# Altium schematic sheet IMU_breakout.SchDoc
size 594 x 420 mm
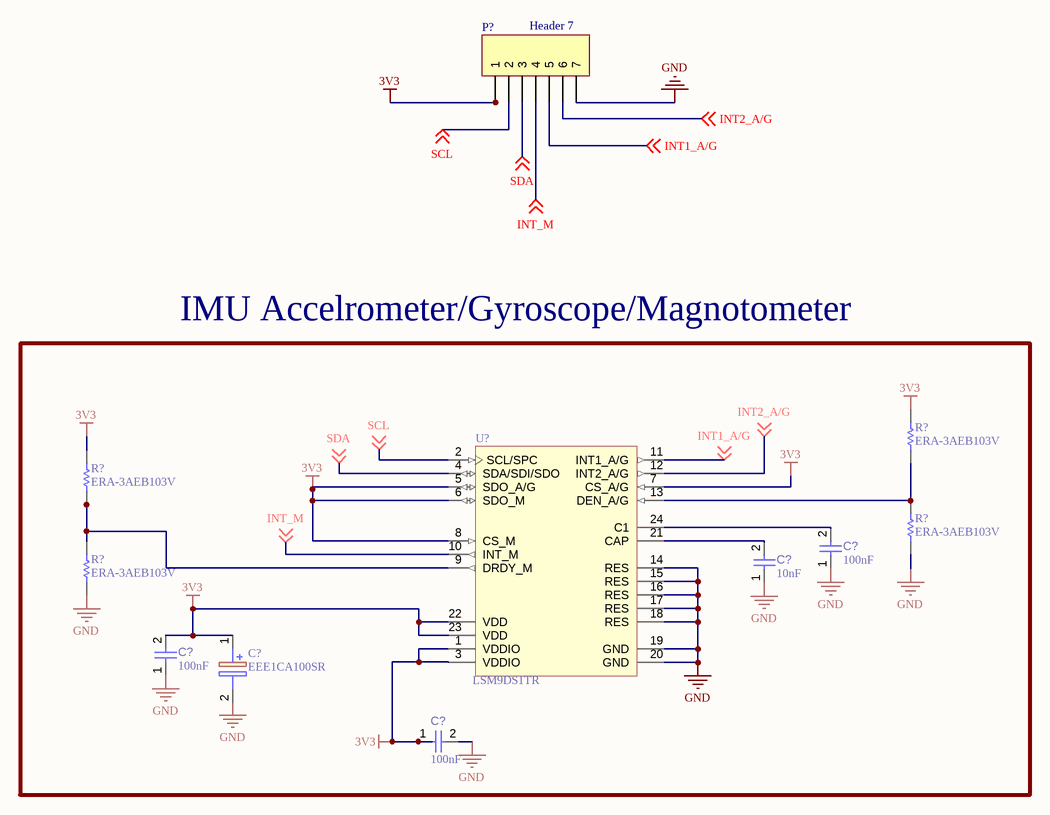
[diagram p0: IMU_breakout.SchDoc]

## Parts
(Parts that share a designator on the sheet are numbered #1, #2 ... from top to bottom, then left to right.)
C?#1  value 100nF  [CAPC1608X90X40ML10T20]  (hidden comment: Capacitor 100 nF +/-10% 50 V 0603)
C?#2  value 10nF  [CAPC0402(1005)60_L]  (hidden comment: Capacitor 10nF +/-20% 50V 0402)
C?#3  EEE1CA100SR  [CAPAE430X550N]
C?#4  value 100nF  [CAPC1608X90X40ML10T20]  (hidden comment: Capacitor 100 nF +/-10% 50 V 0603)
C?#5  value 100nF  [CAPC1608X90X40ML10T20]  (hidden comment: Capacitor 100 nF +/-10% 50 V 0603)
P?  Header 7  [HDR1X7]
R?#1  ERA-3AEB103V  [RESC1608X55X30ML20T20]
R?#2  ERA-3AEB103V  [RESC1608X55X30ML20T20]
R?#3  ERA-3AEB103V  [RESC1608X55X30ML20T20]
R?#4  ERA-3AEB103V  [RESC1608X55X30ML20T20]
U?  LSM9DS1TR  [STM-LGA-24_3500X3000X1000]

## Blocks framed on the sheet
IMU Accelrometer/Gyroscope/Magnotometer: C?#1-C?#5 R?#1-R?#4 U?

## Nets
3V3: C?#3.1(+) C?#4.2 C?#5.1 P?.1 R?#1.2 R?#2.1 U?.1(VDDIO) U?.3(VDDIO) U?.5(SDO_A/G) U?.6(SDO_M) U?.7(CS_A/G) U?.8(CS_M) U?.22(VDD) U?.23(VDD)
GND: C?#1.1 C?#2.1 C?#4.1 C?#5.2 P?.7 R?#3.1 R?#4.2 U?.14(RES) U?.15(RES) U?.16(RES) U?.17(RES) U?.18(RES) U?.19(GND) U?.20(GND)
INT1_A/G: P?.5 U?.11(INT1_A/G) ; off-sheet INT1_A/G
INT2_A/G: P?.6 U?.12(INT2_A/G) ; off-sheet INT2_A/G
INT_M: P?.4 U?.10(INT_M) ; off-sheet INT_M
SCL: P?.2 U?.2(SCL/SPC) ; off-sheet SCL
SDA: P?.3 U?.4(SDA/SDI/SDO) ; off-sheet SDA
NetC?#1_2: C?#1.2 U?.24(C1)
NetC?#2_2: C?#2.2 U?.21(CAP)
NetR?#1_1: R?#1.1 R?#3.2 U?.13(DEN_A/G)
NetR?#2_2: R?#2.2 R?#4.1 U?.9(DRDY_M)

Not connected (* = marked no-connect by the designer): C?#3 2(-)

## Notes on the sheet
- Labels drawn without touching a wire or pin: GND
- 10
- 9
- 8
- 7
- 6
- 5
- 4
- 3
- DWG. NO.
- 2
- 1
- THIS DOCUMENT AND THE DATA DISCLOSED HEREIN OR HEREWITH IS THE PROPERTY OF ALTIUM LIMITED AND MAY BE FREELY DISTRIBUTED IN WHOLE. NO RIGHTS ARE RESERVED OR EXPRESS OR IMPLIED WARANTEE GIVEN.
- REV.
- SHT.
- REVISION
- DESCRIPTION
- DATE
- APPROVED
- H
- G
- F
- E
- D
- C
- B
- A
- TITLE
- SCALE:
- A2
- SIZE
- CAGE CODE
- FILE NAME
- DWG NO.
- SHEET
- OF
- REV

## Library data of the parts
C?#1 C?#4 C?#5 = CMP-001-00017-4: Chip Capacitor, 100 nF, +/- 10%, 50 V, 0603 (1608 Metric); Capacitor Type: Ceramic; Voltage Rating: 50V; RoHS Compliant: True; Max Operating Temperature: 125°C; Pins: 2; Mounting Technology: SM; Min Operating Temperature: -55°C; Tolerance: 10%; Case/Package: 0603
C?#2 = CMP-001-00069-2: Chip Capacitor, 10nF +/-20%, 50V, 0402, Thickness 0.6 mm; Tolerance: 5%; Voltage Rating: 50V; Pins: 2; Max Operating Temperature: 85°C; Mounting Technology: SMT; Min Operating Temperature: -55°C; Case/Package: 0402
C?#3 = EEE1CA100SR: Capacitor Polarised; Manufacturer_Name: Panasonic; Datasheet Link: https://industrial.panasonic.com/cdbs/www-data/pdf/RDE0000/ABA0000C1145.pdf; Height: 5.5mm; Manufacturer_Part_Number: EEE1CA100SR; Arrow Part Number: EEE1CA100SR
P? = Header 7: Header, 7-Pin; LatestRevisionDate: 17-Jul-2002; LatestRevisionNote: Re-released for DXP Platform.; Publisher: Altium Limited
R?#1-R?#4 = CMP-2000-00874-1: Manufacturer: Panasonic; Part Number: ERA-3AEB103V
U? = CMP-2000-06606-1: iNEMO Inertial Module: 3D Accelerometer, 3D Gyroscope, 3D Magnetometer, 1.9 to 3.6 V, -40 to 85 degC, 24-Pin LGA, RoHS, Tape and Reel; Manufacturer: STMicroelectronics; SVHC: NoSVHC(17-Dec-2015); MEMS Module Function: Tri-AxisGyroscope,Tri-AxisAccelerometer,Tri-AxisMagnetometer; Supply Voltage Max: 3.6V; No. of Pins: 24Pins; Gyroscope Range: ±245°/s,±500°/s,±2000°/s; Acceleration Range: ±2g,±4g,±8g,±16g; Supply Voltage Min: 1.9V; Package Description: 24-Pin Plastic Land Grid Array Package, Body 3.65 x 3.15 mm, Pitch 0.43 mm; Manufacturer URL: http://www.st.com/; PartNumber: LSM9DS1; Product Range: -; Packaging: CutTape; Sensor Case Style: LGA; Datasheet URL: http://www2.st.com/content/ccc/resource/technical/document/datasheet/1e/3f/2a/d6/25/eb/48/46/DM00103319.pdf/files/DM00103319.pdf/jcr:content/translations/en.DM00103319.pdf; Package Reference: LGA-24_3500X3000X1000; Mounting Technology: SurfaceMount; Datasheet Version: Rev. 3, 03/2015; MSL: MSL3-168hours